# Altium project Mixed Signal Board design Stm32f4xx.PrjPcb
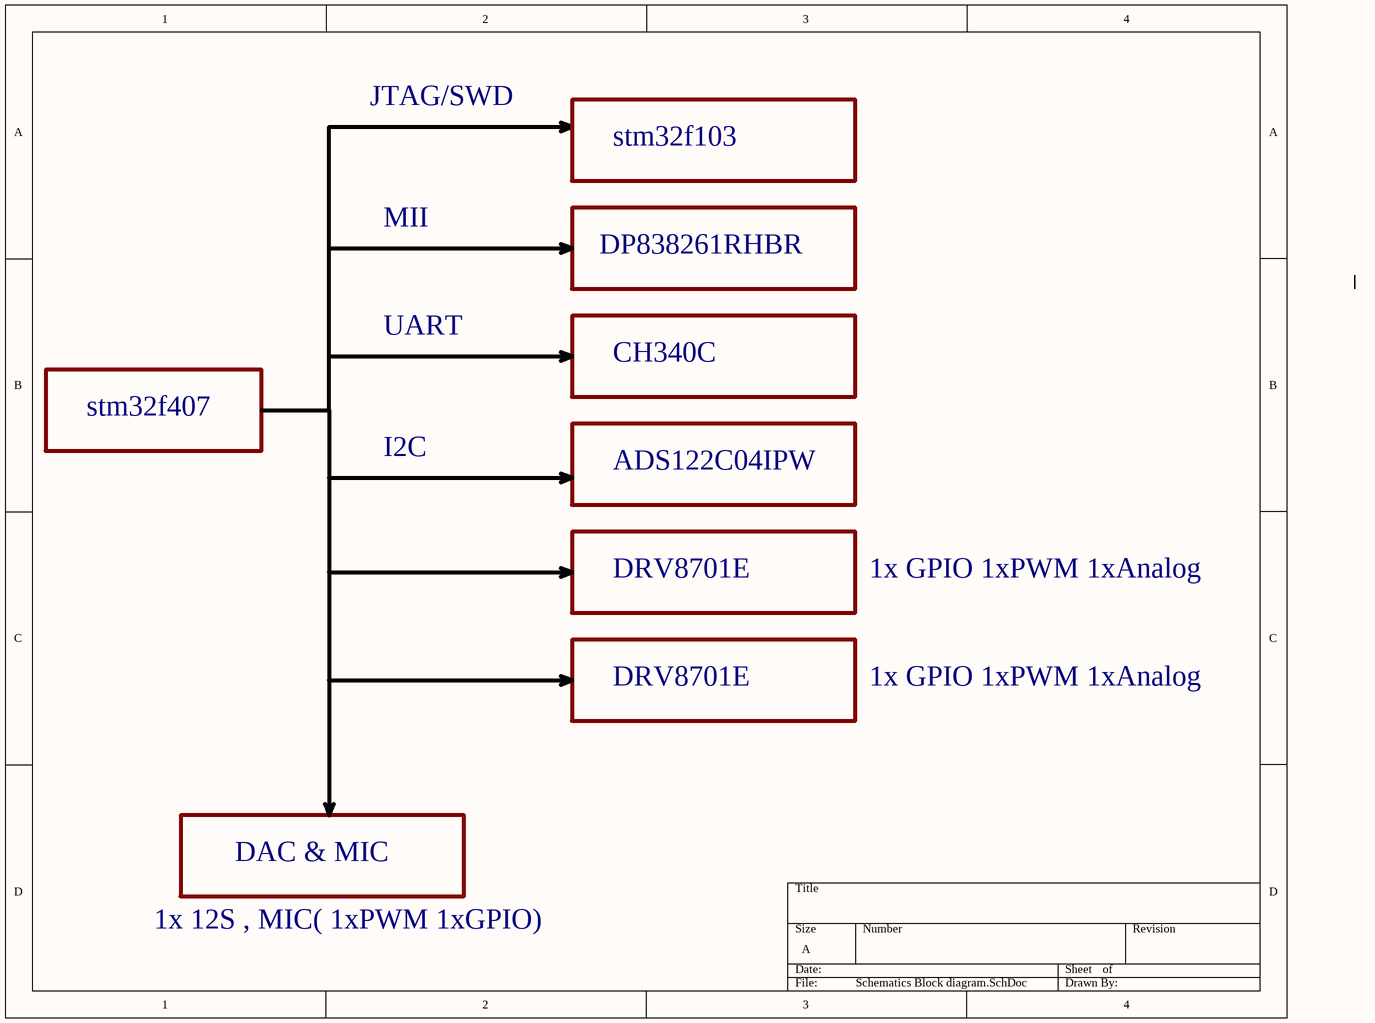
[diagram p0: Schematics Block diagram.SchDoc]
9 sheets, 128 parts. Net scope: flat (ports and power ports of the same name join across sheets).
Sheets:
  Schematics Block diagram.SchDoc
  Power Budget.SchDoc
  stm32f103-debugger.SchDoc
  Ethernet PHY.SchDoc
  Motor Driver.SchDoc
  CH340C UART USB.SchDoc
  ADC Chip.SchDoc
  DAC schematic.SchDoc
  Stm32f407 controller.SchDoc

## Sheet Schematics Block diagram.SchDoc
size A; SheetNumber: 1; SheetTotal: 1

### Notes on the sheet
- JTAG/SWD
- stm32f103
- MII
- DP838261RHBR
- UART
- CH340C
- stm32f407
- I2C
- ADS122C04IPW
- DRV8701E
- 1x GPIO 1xPWM 1xAnalog
- DAC & MIC
- 1x 12S , MIC( 1xPWM 1xGPIO)

## Sheet Power Budget.SchDoc
size A; SheetNumber: 2; SheetTotal: 2
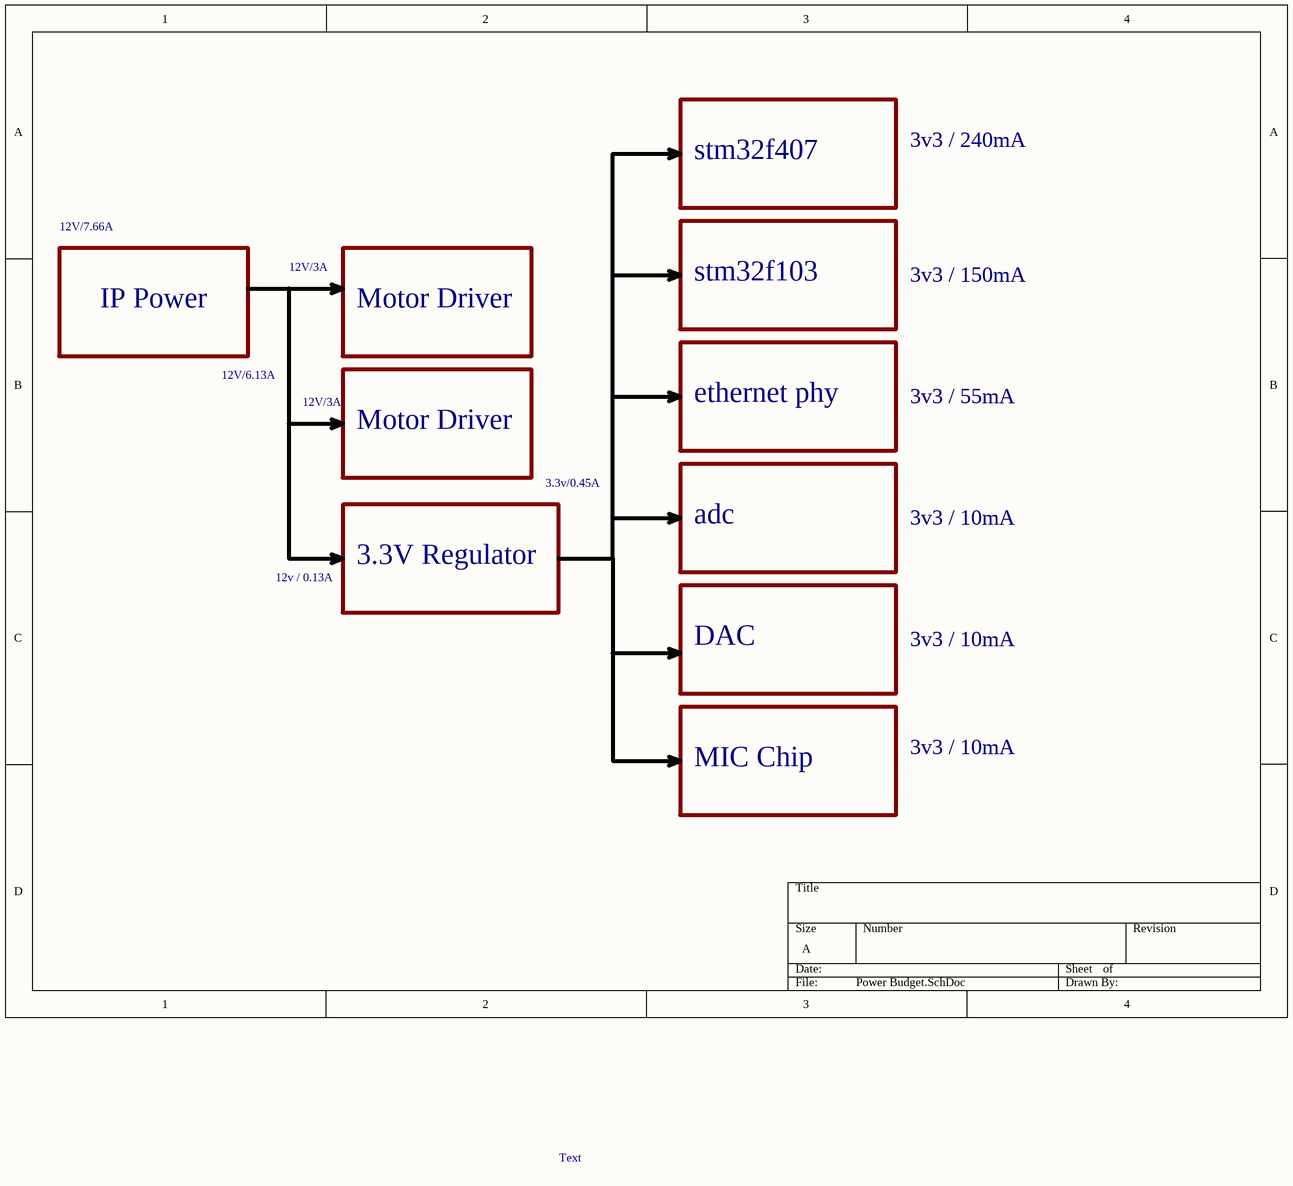
[diagram p1: Power Budget.SchDoc]

### Notes on the sheet
- stm32f407
- 3v3 / 240mA
- 12V/7.66A
- 12V/3A
- stm32f103
- 3v3 / 150mA
- IP Power
- Motor Driver
- 12V/6.13A
- ethernet phy
- 3v3 / 55mA
- 3.3v/0.45A
- 3.3V Regulator
- adc
- 3v3 / 10mA
- 12v / 0.13A
- DAC
- MIC Chip
- Text

## Sheet stm32f103-debugger.SchDoc
size A; SheetNumber: 3; SheetTotal: 3
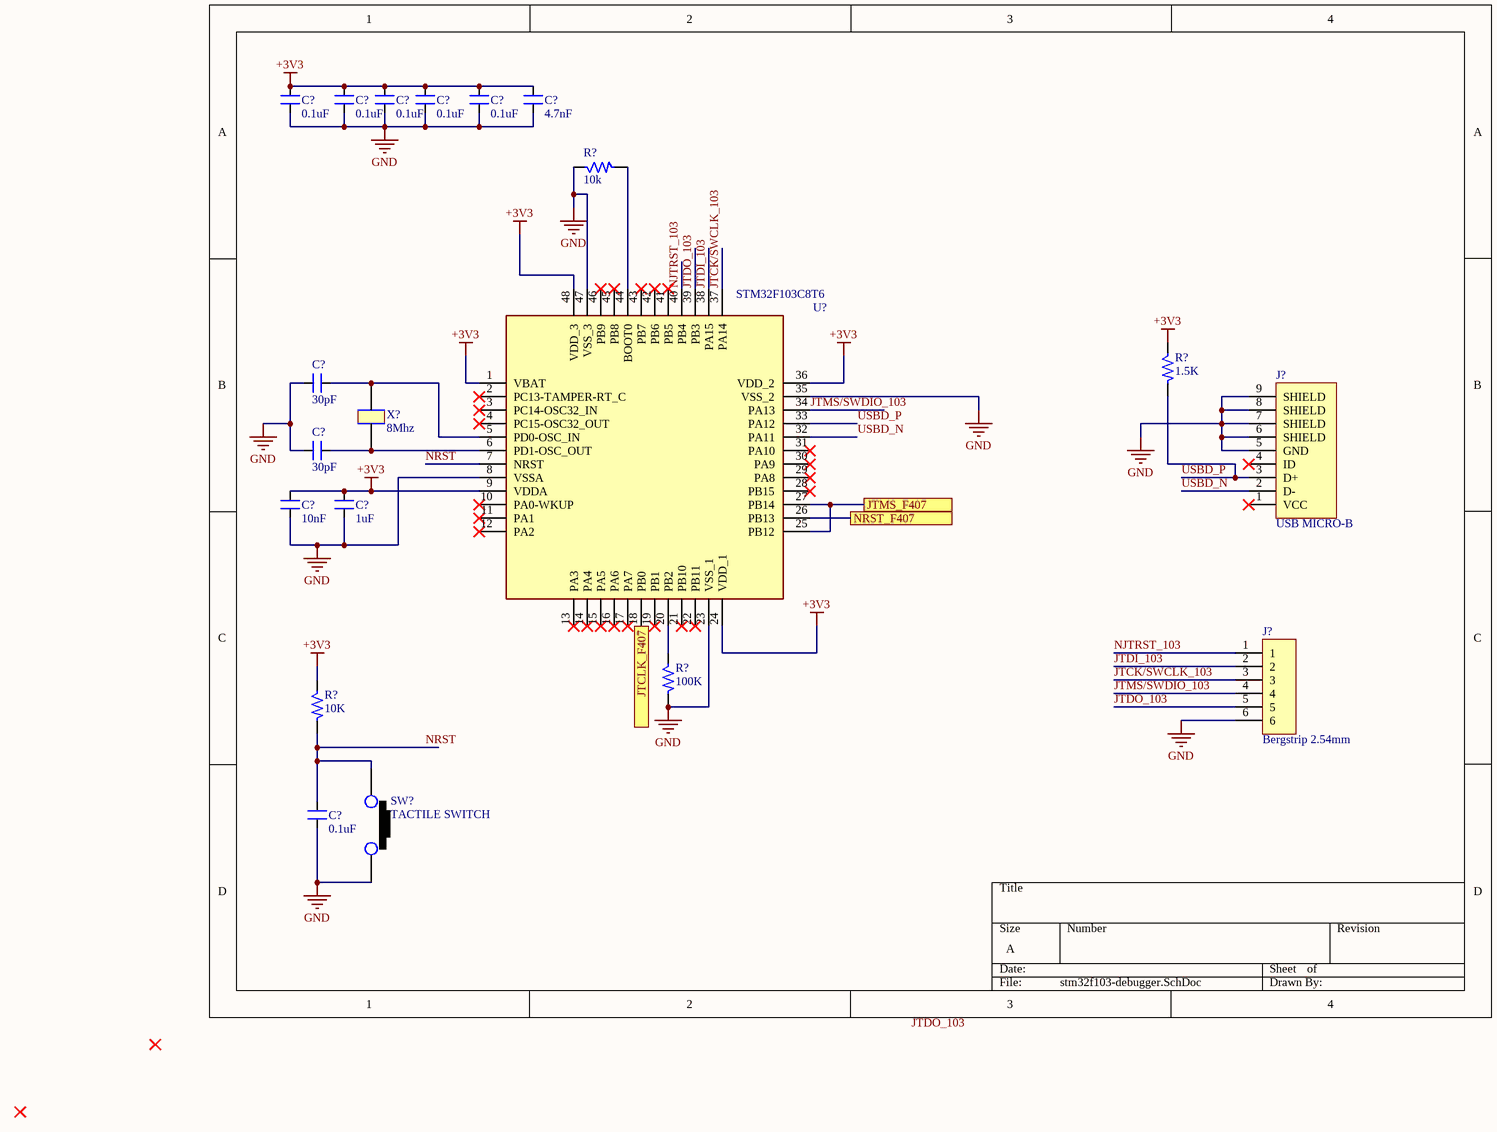
[diagram p2: stm32f103-debugger.SchDoc]

### Parts
(Parts that share a designator on the sheet are numbered #1, #2 ... from top to bottom, then left to right.)
C?#1  0.1uF  [CAP_0805]
C?#2  0.1uF  [CAP_0805]
C?#3  0.1uF  [CAP_0805]
C?#4  0.1uF  [CAP_0805]
C?#5  0.1uF  [CAP_0805]
C?#6  4.7nF  [CAP_0805]
C?#7  30pF  [CAP_0805]
C?#8  30pF  [CAP_0805]
C?#9  10nF  [CAP_0805]
C?#10  1uF  [CAP_0805]
C?#11  0.1uF  [CAP_0805]
J?#1  USB MICRO-B  [CON_10118192-0001LF_SMD]
J?#2  Bergstrip 2.54mm  [CON6_100_59D78_TH_ST]
R?#1  10k  [RES_0603]
R?#2  1.5K  [RES_0805]
R?#3  100K  [RES_0603]
R?#4  10K  [RES_0603]
SW?#1  TACTILE SWITCH  [SW_342_SMD]
U?#1  STM32F103C8T6  [LQFP-48_19.6_393_58X11_SMD]
X?#1  8Mhz  [XTAL_314_240X47_SMD]

### Ports
JTCLK_F407, JTMS_F407, NRST_F407

### Nets
+3V3: C?#1.1 C?#2.1 C?#3.1 C?#4.1 C?#5.1 C?#6.1 C?#9.1 C?#10.1 R?#2.1 R?#4.1 U?#1.1(VBAT) U?#1.9(VDDA) U?#1.24(VDD_1) U?#1.36(VDD_2) U?#1.48(VDD_3)
GND: C?#1.2 C?#2.2 C?#3.2 C?#4.2 C?#5.2 C?#6.2 C?#7.1 C?#8.1 C?#9.2 C?#10.2 C?#11.2 J?#1.5(GND) J?#1.6(SHIELD) J?#1.7(SHIELD) J?#1.8(SHIELD) J?#1.9(SHIELD) J?#2.6 R?#1.1 R?#3.2 SW?#1.2 U?#1.8(VSSA) U?#1.23(VSS_1) U?#1.35(VSS_2) U?#1.47(VSS_3)  [project net SN]
JTCK/SWCLK_103: J?#2.3 U?#1.37(PA14)
JTDI_103: J?#2.2 U?#1.38(PA15)
JTDO_103: J?#2.5 U?#1.39(PB3)
JTMS/SWDIO_103: J?#2.4 U?#1.34(PA13)
NJTRST_103: J?#2.1 U?#1.40(PB4)
NRST: C?#11.1 R?#4.2 SW?#1.1 U?#1.7(NRST)
USBD_N: J?#1.2(D-) U?#1.32(PA11)
USBD_P: J?#1.3(D+) R?#2.2 U?#1.33(PA12)
NetC?#7_2: C?#7.2 U?#1.5(PD0-OSC_IN) X?#1.1
NetC?#8_2: C?#8.2 U?#1.6(PD1-OSC_OUT) X?#1.2
NetR?#1_2: R?#1.2 U?#1.44(BOOT0)
NetR?#3_1: R?#3.1 U?#1.20(PB2)
NetU?#1_18: U?#1.18(PB0) ; port JTCLK_F407
NetU?#1_25: U?#1.25(PB12) U?#1.27(PB14) ; port JTMS_F407
NetU?#1_26: U?#1.26(PB13) ; port NRST_F407

Not connected (* = marked no-connect by the designer): J?#1 1(VCC)* 4(ID)*; U?#1 2(PC13-TAMPER-RT_C)* 3(PC14-OSC32_IN)* 4(PC15-OSC32_OUT)* 10(PA0-WKUP)* 11(PA1)* 12(PA2)* 13(PA3)* 14(PA4)* 15(PA5)* 16(PA6)* 17(PA7)* 19(PB1)* 21(PB10)* 22(PB11)* 28(PB15)* 29(PA8)* 30(PA9)* 31(PA10)* 41(PB5)* 42(PB6)* 43(PB7)* 45(PB8)* 46(PB9)*

### Notes on the sheet
- Labels drawn without touching a wire or pin: JTDO_103

### Library data of the parts
C?#1-C?#5 = CAP_0.1uF-50V-10%-0805: 0.1µF ±10% 50V Ceramic Capacitor X7R 0805 (2012 Metric); Manufacturer: Samsung; Manufacturer Part Number: CL21B104KBCNNNC; Alternate Part Number-1: NA; Case/Package: 0805; Supplier-1: SIRICOM; Supplier Part Number-1: 0805B104K500CT
C?#6 = CAP_4.7nF-50V-10%-0805: 4700pF ±10% 50V Ceramic Capacitor X7R 0805 (2012 Metric); Manufacturer: TDK; Manufacturer Part Number: C0805C472K5RECAUTO; Alternate Part Number-1: NA; Case/Package: 0805; Supplier-1: SIRICOM; Supplier Part Number-1: 0805N472J500LT
C?#7 C?#8 = CAP_30pF-50V-10%-0805: ±10% 50V Ceramic Capacitor C0G, NP0 0805 (2012 Metric); Manufacturer Part Number: C0805C300K5GAC7800; Manufacturer: KEMET; Alternate Part Number: NA; Case/Package: 0805; Supplier-1: Digikey; Supplier Part Number-1: 399-17443-1-ND - Cut Tape (CT)
C?#9 = CAP_10nF-50V-10%-0805: 10000pF ±10% 50V Ceramic Capacitor X7R 0805 (2012 Metric); Manufacturer: Samsung; Manufacturer Part Number: C0805C103K5RECAUTO; Alternate Part Number-1: GRM2195C1H103JA01D; Case/Package: 0805; Supplier-1: SIRICOM; Supplier Part Number-1: 0805B103K500CT
C?#10 = CAP_1uF-50V-5%-0805: 1µF ±5% 50V Ceramic Capacitor X7R 0805 (2012 Metric); Manufacturer: Samsung; Manufacturer Part Number: CC0805JKX7R9BB105; Alternate Part Number-1: 0805F105M500NT; Case/Package: 0805; Supplier-1: SIRICOM; Supplier Part Number-1: CL21B105KBFNNNE
C?#11 = CAP_0.1uF-50V-5%-0805: 0.1µF ±5% 50V Ceramic Capacitor X7R 0805 (2012 Metric); Manufacturer: AVX Corporation; Manufacturer Part Number: 08055C104JAT4A; Alternate Part Number-1: 0805B104M500; Case/Package: 0805; Supplier-1: SIRICOM; Supplier Part Number-1: 0805B104J500CT
J?#1 = CON_USB2.0_MICROB-SMD: USB - micro B USB 2.0 Receptacle Connector 5 Position Surface Mount, Right Angle; Manufacturer: ICC; Manufacturer Part Number: 10118192-0001LF; Alternate Part Number-1: NA; Case/Package: USB MICRO-B SMD; Supplier-1: SUNROM; Supplier Part Number-1: MICRO USB
J?#2 = CON-BS-SKT_6X1-100-ST-TH: 6 Pins, 1 Row 2.54mm Pitch, Straight bergstrip, Female; Manufacturer: Molex; Alternate Part Number-1: NA; Manufacturer Part Number: 22-10-2061; Case/Package: TH-CON; Supplier-1: SP ROAD; Supplier Part Number-1: NA
R?#1 R?#3 = RES_100K-0.1W-1%-0603: 100 kOhms ±1% 0.1W, 1/10W Chip Resistor 0603 (1608 Metric) Automotive AEC-Q200 Thick Film; Manufacturer: Stackpole Electronics; Manufacturer Part Number: RMCF0603FT100K; Alternate Part Number-1: NA; Case/Package: 0603; Supplier-1: Arrow; Supplier Part Number-1: RMCF0603FT100K
R?#2 = RES_1.5K-0.125W-1%-0805: 1.5 kOhms ±1% 0.125W, 1/8W Chip Resistor 0805 (2012 Metric) Thick Film; Manufacturer: TE Connectivity Passive Product; Manufacturer Part Number: CRG0805F1K5; Alternate Part Number-1: NA; Case/Package: 0805; Supplier-1: SIRICOM; Supplier Part Number-1: NA
R?#4 = RES_10K-0.1W-1%-0603: 10 kOhms ±1% 0.1W, 1/10W Chip Resistor 0603 (1608 Metric) Automotive AEC-Q200 Thick Film; Manufacturer: Walsin; Manufacturer Part Number: WR06X1002FTL; Alternate Part Number-1: 0603WAJ0103T5E; Case/Package: 0603; Supplier-1: SIRICOM; Supplier Part Number-1: WR06X1002FTL
SW?#1 = SW1_RS-282G05A3-SMRT-SMD: Tactile Switch SPST-NO Top Actuated Surface Mount; Manufacturer: ITT C&K; Alternate Part Number-1: NA; Manufacturer Part Number: RS-282G05A3-SMRT; Case/Package: SMD; Supplier-1: SP ROAD; Supplier Part Number-1: RS-282G05A3-SMRT
U?#1 = IC_STM32F103C8T6: ARM® Cortex®-M3 STM32F1 Microcontroller IC 32-Bit 72MHz 64KB (64K x 8) FLASH 48-LQFP (7x7); Manufacturer: STMicroelectronics; Alternate Part Number-1: NA; Manufacturer Part Number: STM32F103C8T6; Case/Package: LQFP48; Supplier-1: LCSC; Supplier Part Number-1: STM32F103C8T6
X?#1 = XTAL_8MHZ-ECS-80-32-5PX-SMD: 8MHz ±30ppm Crystal 32pF 60 Ohms HC-49/US; Manufacturer: Fox Electronics; Manufacturer Part Number: ECS-80-32-5PX-TR; Alternate Part Number-1: NA; Case/Package: SMD/SMT; Supplier-1: SP ROAD; Supplier Part Number-1: ECS-80-32-5PX-TR

## Sheet Ethernet PHY.SchDoc
size A; SheetNumber: 4; SheetTotal: 4
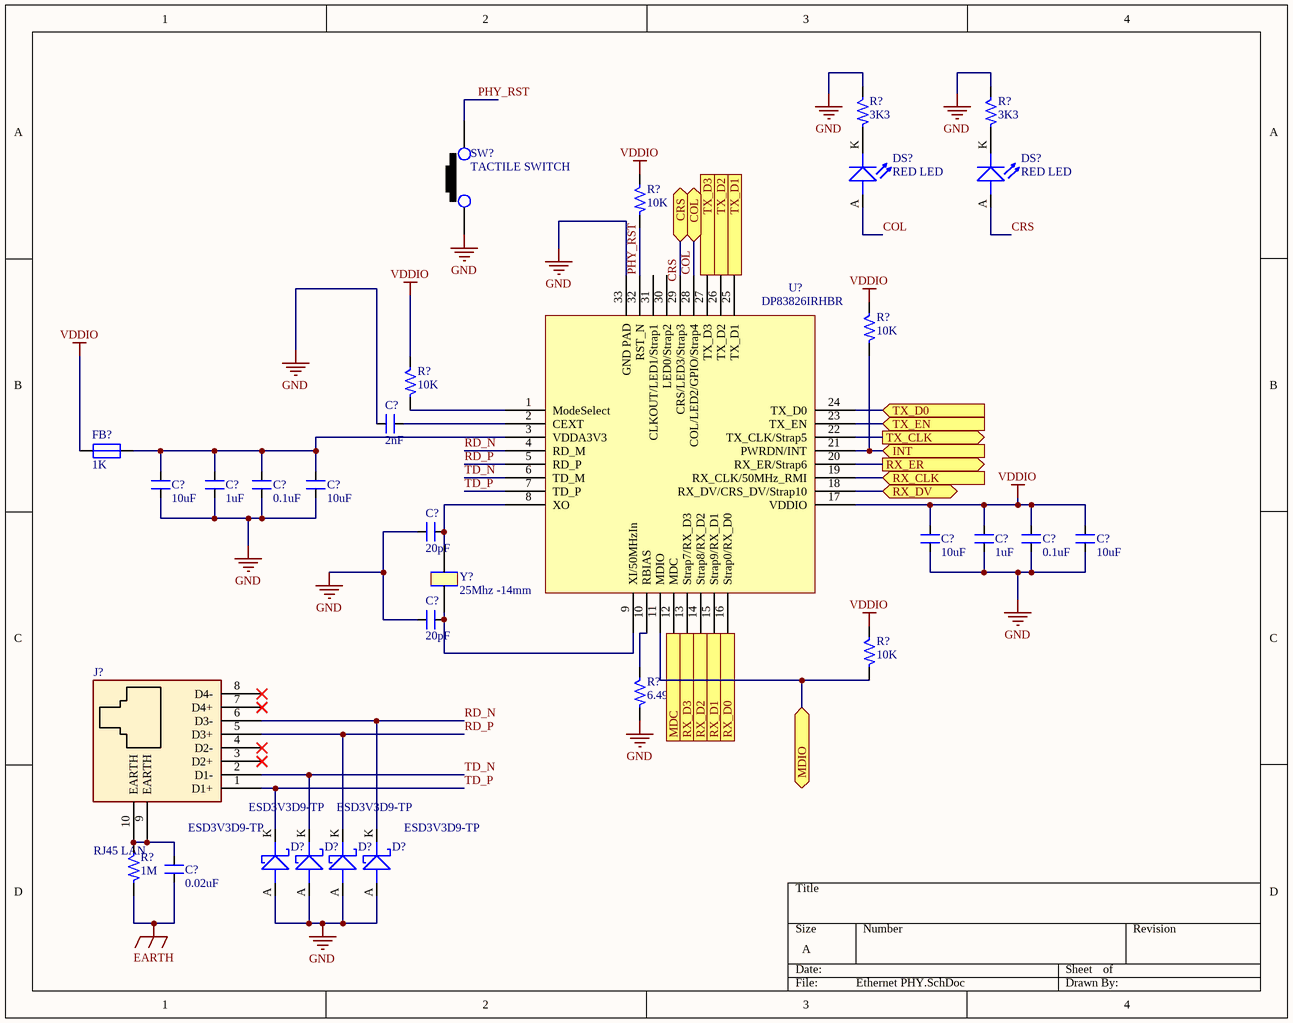
[diagram p3: Ethernet PHY.SchDoc]

### Parts
(Parts that share a designator on the sheet are numbered #1, #2 ... from top to bottom, then left to right.)
C?#12  2nF  [CAP_0805]
C?#13  10uF  [CAP_1206]
C?#14  1uF  [CAP_0805]
C?#15  0.1uF  [CAP_0805]
C?#16  10uF  [CAP_1206]
C?#17  20pF  [CAP_0805]
C?#18  10uF  [CAP_1206]
C?#19  1uF  [CAP_0805]
C?#20  0.1uF  [CAP_0805]
C?#21  10uF  [CAP_1206]
C?#22  20pF  [CAP_0805]
C?#23  0.02uF  [CAP_1812]
D?#1  ESD3V3D9-TP  [DIO_SOD-923]
D?#2  ESD3V3D9-TP  [DIO_SOD-923]
D?#3  ESD3V3D9-TP  [DIO_SOD-923]
D?#4  ESD3V3D9-TP  [DIO_SOD-923]
DS?#1  RED LED  [LED_0805]
DS?#2  RED LED  [LED_0805]
FB?#1  1K  [IND_0805]
J?#3  RJ45 LAN  [CON10_P106_RJ45_TH_ST]
R?#5  3K3  [RES_0603]
R?#6  3K3  [RES_0603]
R?#7  10K  [RES_0603]
R?#8  10K  [RES_0603]
R?#9  10K  [RES_0603]
R?#10  10K  [RES_0805]
R?#11  6.49K  [RES_0805]
R?#12  1M  [RES_1206]
SW?#2  TACTILE SWITCH  [SW_342_SMD]
U?#2  DP83826IRHBR  [VQFN32_19_218_23X9_SMD]
Y?  25Mhz -14mm  [XTAL_314_240X47_SMD]

### Ports
COL (bidir), CRS (bidir), INT (in), MDC (in), MDIO (bidir), RX_CLK (in), RX_D0 (out), RX_D1 (out), RX_D2 (out), RX_D3 (out), RX_DV (bidir), RX_ER (out), TX_CLK (out), TX_D0 (in), TX_D1 (in), TX_D2 (in), TX_D3 (in), TX_EN (in)

### Nets
EARTH: C?#23.1 R?#12.2
GND: C?#12.1 C?#13.2 C?#14.2 C?#15.2 C?#16.2 C?#17.1 C?#18.2 C?#19.2 C?#20.2 C?#21.2 C?#22.1 D?#1.A D?#2.A D?#3.A D?#4.A R?#5.1 R?#6.1 R?#11.2 SW?#2.1 U?#2.33(GND_PAD)  [project net SN]
VDDIO: C?#18.1 C?#19.1 C?#20.1 C?#21.1 FB?#1.1 R?#7.1 R?#8.1 R?#9.1 R?#10.1 U?#2.17(VDDIO)
COL: DS?#1.A(ANODE) U?#2.28(COL/LED2/GPIO/Strap4) ; port COL
CRS: DS?#2.A(ANODE)
PHY_RST: R?#7.2 SW?#2.2 U?#2.32(RST_N)
RD_N: D?#4.K J?#3.6(D3-) U?#2.4(RD_M)
RD_P: D?#3.K J?#3.5(D3+) U?#2.5(RD_P)
TD_N: D?#2.K J?#3.2(D1-) U?#2.6(TD_M)
TD_P: D?#1.K J?#3.1(D1+) U?#2.7(TD_P)
NetC?#12_2: C?#12.2 U?#2.2(CEXT)
NetC?#13_1: C?#13.1 C?#14.1 C?#15.1 C?#16.1 FB?#1.2 U?#2.3(VDDA3V3)
NetC?#17_2: C?#17.2 U?#2.8(XO) Y?.1
NetC?#22_2: C?#22.2 U?#2.9(XI/50MHzIn) Y?.2
NetC?#23_2: C?#23.2 J?#3.9(EARTH) J?#3.10(EARTH) R?#12.1
NetDS?#1_K: DS?#1.K(CATHODE) R?#5.2
NetDS?#2_K: DS?#2.K(CATHODE) R?#6.2
NetR?#8_2: R?#8.2 U?#2.21(PWRDN/INT) ; port INT
NetR?#9_2: R?#9.2 U?#2.1(ModeSelect)
NetR?#10_2: R?#10.2 U?#2.11(MDIO) ; port MDIO
NetR?#11_1: R?#11.1 U?#2.10(RBIAS)
NetU?#2_12: U?#2.12(MDC) ; port MDC
NetU?#2_13: U?#2.13(Strap7/RX_D3) ; port RX_D3
NetU?#2_14: U?#2.14(Strap8/RX_D2) ; port RX_D2
NetU?#2_15: U?#2.15(Strap9/RX_D1) ; port RX_D1
NetU?#2_16: U?#2.16(Strap0/RX_D0) ; port RX_D0
NetU?#2_18: U?#2.18(RX_DV/CRS_DV/Strap10) ; port RX_DV
NetU?#2_19: U?#2.19(RX_CLK/50MHz_RMI) ; port RX_CLK
NetU?#2_20: U?#2.20(RX_ER/Strap6) ; port RX_ER
NetU?#2_22: U?#2.22(TX_CLK/Strap5) ; port TX_CLK
NetU?#2_23: U?#2.23(TX_EN) ; port TX_EN
NetU?#2_24: U?#2.24(TX_D0) ; port TX_D0
NetU?#2_25: U?#2.25(TX_D1) ; port TX_D1
NetU?#2_26: U?#2.26(TX_D2) ; port TX_D2
NetU?#2_27: U?#2.27(TX_D3) ; port TX_D3
NetU?#2_29: U?#2.29(CRS/LED3/Strap3) ; port CRS

Not connected (* = marked no-connect by the designer): J?#3 3(D2+)* 4(D2-)* 7(D4+)* 8(D4-)*; U?#2 30(LED0/Strap2) 31(CLKOUT/LED1/Strap1)

### Notes on the sheet
- Labels drawn without touching a wire or pin: CRS

### Library data of the parts
C?#12 = CAP_2nF-50V-10%-0805: 2000pF ±10% 50V Ceramic Capacitor X7R 0805 (2012 Metric); Manufacturer: Samsung Electro-Mechanics; Manufacturer Part Number: CL21B202KBANNNC; Alternate Part Number-1: NA; Case/Package: 0805; Supplier-1: Digikey; Supplier Part Number-1: 1276-2471-1-ND - Cut Tape (CT)
C?#13 C?#16 C?#18 C?#21 = CAP_10uF-50V-10%-1206: 10µF ±10% 50V Ceramic Capacitor X7R 1206 (3216 Metric); Manufacturer: KEMET; Manufacturer Part Number: CL31B106KBHNNNE; Alternate Part Number-1: GRT31CR61H106ME01L; Case/Package: 1206; Supplier-1: SIRICOM; Supplier Part Number-1: CC1206KKX5R9BB106
C?#14 C?#19 = CAP_1uF-50V-5%-0805: as C?#10 on sheet stm32f103-debugger; Case/Package: 0805; Supplier-1: SIRICOM; Supplier Part Number-1: CL21B105KBFNNNE
C?#15 C?#20 = CAP_0.1uF-50V-5%-0805: as C?#11 on sheet stm32f103-debugger; Case/Package: 0805; Supplier-1: SIRICOM; Supplier Part Number-1: 0805B104J500CT
C?#17 C?#22 = CAP_20pF-50V-10%-0805: ±10% 50V Ceramic Capacitor C0G, NP0 0805 (2012 Metric); Manufacturer: AVX Corporation; Manufacturer Part Number: 08055A200KAT2A; Alternate Part Number-1: NA; Case/Package: 0805; Supplier-1: Digikey; Supplier Part Number-1: 478-11887-1-ND - Cut Tape (CT)
C?#23 = CAP_20nF-1KV-20%-1812: 0.02µF ±20% 1000V (1kV) Ceramic Capacitor X7R 1812 (4532 Metric); Manufacturer: TDK; Manufacturer Part Number: 1812AC203MAT1A; Alternate Part Number-1: NA; Case/Package: 1812; Supplier-1: Mouser; Supplier Part Number-1: 581-1812AC203M
D?#1-D?#4 = DIO-T_3.3V-8.8V-SOD923: 8.8V Clamp 5A (8/20µs) Ipp Tvs Diode Surface Mount SOD-923; Manufacturer: Micro Commercial Co; Alternate Part Number-1: NA; Manufacturer Part Number: ESD3V3D9-TP; Case/Package: SOD923; Supplier-1: Digikey; Supplier Part Number-1: ESD3V3D9-TPMSCT-ND - Cut Tape (CT)
DS?#1 DS?#2 = LED_RED-2V-20mA-0805: Red 631nm LED Indication - Discrete 2V 0805 (2012 Metric); Manufacturer: Vishay Lite-On; Manufacturer Part Number: LTST-C171KRKT; Alternate Part Number-1: NA; Case/Package: 0805; Supplier-1: SP ROAD; Supplier Part Number-1: LTST-C171KRKT
FB?#1 = FB_1K-100MHZ-1.6A-0805: 1 kOhms @ 100MHz 1 Power Line Ferrite Bead 0805 (2012 Metric) 1.6A; Manufacturer: Laird; Manufacturer Part Number: BLM21SP102SH1D; Alternate Part Number-1: NA; Case/Package: 0805; Supplier-1: SIRICOM; Supplier Part Number-1: ACMS201209A102
J?#3 = CON-SKT-RJ_8C8P-RA-TH: 8 Pins, 2 Row 2.54mm Pitch, right angle Connector, male; Manufacturer: Assmann; Manufacturer Part Number: A-2004-2-4-LPS-N-R; Alternate Part Number-1: NA; Case/Package: TH-CON; Supplier-1: SP ROAD; Supplier Part Number-1: A-2004-2-4-LPS-N-R
R?#5 R?#6 = RES_3.3K-0.1W-1%-0603: 3.3 kOhms ±1% 0.1W, 1/10W Chip Resistor 0603 (1608 Metric) Automotive AEC-Q200 Thick Film; Manufacturer: Wilson; Manufacturer Part Number: WR06X3301FTL; Alternate Part Number-1: 0603WAF3301T5E; Case/Package: 0603; Supplier-1: SIRICOM; Supplier Part Number-1: WR06X3301FTL
R?#7-R?#9 = RES_10K-0.1W-1%-0603: as R?#4 on sheet stm32f103-debugger; Case/Package: 0603; Supplier-1: SIRICOM; Supplier Part Number-1: WR06X1002FTL
R?#10 = RES_10K-0.125W-1%-0805: 10 kOhms ±1% 0.125W, 1/8W Chip Resistor 0805 (2012 Metric) Automotive AEC-Q200 Thick Film; Manufacturer: CTS; Manufacturer Part Number: WR08X1002FTL; Case/Package: 0805; Supplier-1: SIRICOM; Supplier Part Number-1: WR08X1002FTL; Alternate Part Number-1: WR08X1002FTL
R?#11 = RES_6.49K-0.125W-1%-0805: 6.49 kOhms ±1% 0.125W, 1/8W Chip Resistor 0805 (2012 Metric) Moisture Resistant Thick Film; Manufacturer: Stackpole Electronics; Manufacturer Part Number: RC0805FR-076K49L; Alternate Part Number-1: NA; Case/Package: 0805; Supplier-1: SIRICOM; Supplier Part Number-1: WRO8X6491FTL
R?#12 = RES_1M-0.25W-1%-1206: 1 MOhms ±1% 0.25W, 1/4W Chip Resistor 1206 (3216 Metric) Automotive AEC-Q200, High Voltage Thick Film; Manufacturer: Walsin; Manufacturer Part Number: WR12X1004FTL; Alternate Part Number-1: NA; Case/Package: 1206; Supplier-1: SIRICOM; Supplier Part Number-1: WR12X1004FTL
SW?#2 = SW1_RS-282G05A3-SMRT-SMD: as SW?#1 on sheet stm32f103-debugger; Manufacturer Part Number: RS-282G05A3-SMRT; Case/Package: SMD; Supplier-1: SP ROAD; Supplier Part Number-1: RS-282G05A3-SMRT
U?#2 = IC_DP83826IRHBR: Ethernet ICs Low latency 10/100-Mbps PHY, MII interface and enhanced mode with an industrial temperature range 32-VQFN -40 to 85; Manufacturer: Texas Instruments; Alternate Part Number-1: NA; Manufacturer Part Number: DP83826IRHBR; Case/Package: 32-VQFN; Supplier-1: Mouser; Supplier Part Number-1: 595-DP83826IRHBR
Y? = XTAL_25Mhz-FOXSDLF/250F-20: 25MHz ±30ppm Crystal 20pF 30 Ohms HC-49/US; Manufacturer: Abracon; Alternate Part Number-1: NA; Manufacturer Part Number: FOXSDLF/250F-20; Case/Package: SMD; Supplier-1: MOUSER; Supplier Part Number-1: FOXSDLF/250F-20

## Sheet Motor Driver.SchDoc
size A; SheetNumber: 5; SheetTotal: 6
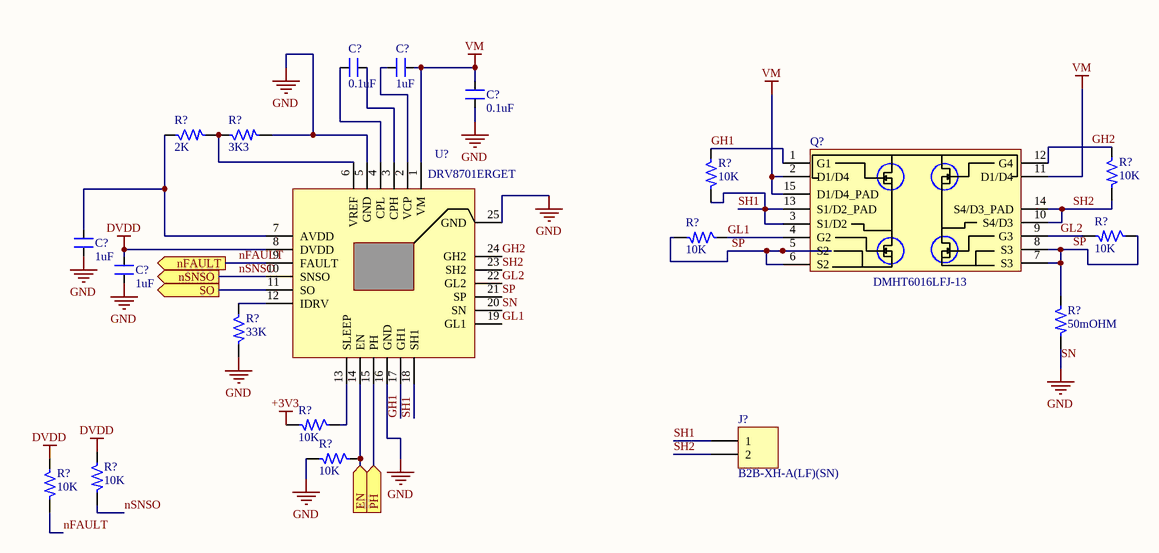
[diagram p4: Motor Driver.SchDoc]

### Parts
(Parts that share a designator on the sheet are numbered #1, #2 ... from top to bottom, then left to right.)
C?#24  0.1uF  [CAP_0805]
C?#25  1uF  [CAP_0805]
C?#26  0.1uF  [CAP_0805]
C?#27  1uF  [CAP_0805]
C?#28  1uF  [CAP_0805]
J?#4  B2B-XH-A(LF)(SN)  [CON2_100_B2B-XH-A_TH_ST]
Q?  DMHT6016LFJ-13  [DFN5045-12_33_212_27X15_SMD_1]
R?#13  2K  [RES_0603]
R?#14  3K3  [RES_0603]
R?#15  10K  [RES_0603]
R?#16  10K  [RES_0603]
R?#17  10K  [RES_0603]
R?#18  10K  [RES_0603]
R?#19  50mOHM  [RES_2512]
R?#20  33K  [RES_0805]
R?#21  10K  [RES_0603]
R?#22  10K  [RES_0603]
R?#23  10K  [RES_0603]
R?#24  10K  [RES_0603]
U?#3  DRV8701ERGET  [VFQFN24_19.6_196_12X32_SMD_1]

### Ports
EN (in), nFAULT (out), nSNSO (out), PH (in), SO (out)

### Nets
+3V3: R?#21.2
DVDD: C?#28.1 R?#22.1 R?#23.1 U?#3.8(DVDD)
SN: C?#26.2 C?#27.2 C?#28.2 R?#14.2 R?#19.2 R?#20.2 R?#24.2 U?#3.5(GND) U?#3.16(GND) U?#3.20(SN) U?#3.25(GND)  [also labelled GND]
VM: C?#25.2 C?#26.1 Q?.2(D1/D4) Q?.11(D1/D4) Q?.15(D1/D4_PAD) U?#3.1(VM)
GH1: Q?.1(G1) R?#15.1 U?#3.17(GH1)
GH2: Q?.12(G4) R?#16.1 U?#3.24(GH2)
GL1: Q?.4(G2) R?#17.1 U?#3.19(GL1)
GL2: Q?.9(G3) R?#18.2 U?#3.22(GL2)
nFAULT: R?#23.2 U?#3.9(FAULT) ; port nFAULT
nSNSO: R?#22.2 U?#3.10(SNSO) ; port nSNSO
SH1: J?#4.1 Q?.3(S1/D2) Q?.13(S1/D2_PAD) R?#15.2 U?#3.18(SH1)
SH2: J?#4.2 Q?.10(S4/D3) Q?.14(S4/D3_PAD) R?#16.2 U?#3.23(SH2)
SP: Q?.5(S2) Q?.6(S2) Q?.7(S3) Q?.8(S3) R?#17.2 R?#18.1 R?#19.1 U?#3.21(SP)
NetC?#24_1: C?#24.1 U?#3.3(CPH)
NetC?#24_2: C?#24.2 U?#3.4(CPL)
NetC?#25_1: C?#25.1 U?#3.2(VCP)
NetC?#27_1: C?#27.1 R?#13.1 U?#3.7(AVDD)
NetR?#13_2: R?#13.2 R?#14.1 U?#3.6(VREF)
NetR?#20_1: R?#20.1 U?#3.12(IDRV)
NetR?#21_1: R?#21.1 U?#3.13(SLEEP)
NetR?#24_1: R?#24.1 U?#3.14(EN) ; port EN
NetU?#3_11: U?#3.11(SO) ; port SO
NetU?#3_15: U?#3.15(PH) ; port PH

### Library data of the parts
C?#24 C?#26 = CAP_0.1uF-50V-5%-0805: as C?#11 on sheet stm32f103-debugger; Case/Package: 0805; Supplier-1: SIRICOM; Supplier Part Number-1: 0805B104J500CT
C?#25 C?#27 C?#28 = CAP_1uF-50V-5%-0805: as C?#10 on sheet stm32f103-debugger; Case/Package: 0805; Supplier-1: SIRICOM; Supplier Part Number-1: CL21B105KBFNNNE
J?#4 = CON-PLG_2X1-100-ST-TH: 2 Pins, 1 Row 2.54mm Pitch, Straight Connector, male; Manufacturer: JST; Mating Part Number: XHP-2; Crimp Part Number: ASXHSXH22K51; Alternate Part Number-1: NA; Manufacturer Part Number: B2B-XH-A(LF)(SN); Case/Package: TH-CON; Supplier-1: SP ROAD; Supplier Part Number-1: B2B-XH-A(LF)(SN)
Q? = MOSFET-N_60V-14.8A-V-DFN5045-12: Mosfet Array 4 N-Channel 14.8A (Ta) Surface Mount V-DFN5045-12; Manufacturer: ON Semiconductor; Alternate Part Number-1: DMHT3006LFJ-13; Manufacturer Part Number: DMHT6016LFJ-13; Case/Package: DFN5045-12; Supplier-1: LCSC; Supplier Part Number-1: C460986
R?#13 = RES_2K-0.125W-1%-0603: 2 kOhms ±1% 0.125W, 1/8W Chip Resistor 0603 (1608 Metric) Anti-Sulfur, Moisture Resistant Thin Film; Manufacturer: Stackpole Electronics; Manufacturer Part Number: RNCP0603FTD2K00; Alternate Part Number-1: NA; Case/Package: 0603; Supplier-1: SIRICOM; Supplier Part Number-1: WR06X2001FTL
R?#14 = RES_3.3K-0.1W-1%-0603: as R?#5 on sheet Ethernet PHY; Case/Package: 0603; Supplier-1: SIRICOM; Supplier Part Number-1: WR06X3301FTL
R?#15-R?#18 R?#21-R?#24 = RES_10K-0.1W-1%-0603: as R?#4 on sheet stm32f103-debugger; Case/Package: 0603; Supplier-1: SIRICOM; Supplier Part Number-1: WR06X1002FTL
R?#19 = RES_50mOhm-2W-1%-2512: 50 mOhms ±1% 2W Chip Resistor 2512 (6432 Metric) Automotive AEC-Q200, Current Sense, Moisture Resistant Metal Element; Manufacturer: Yageo; Manufacturer Part Number: PA2512FKF7W0R05E; Alternate Part Number-1: PMR100HZPFU5L00; Case/Package: 2512; Supplier-1: SIRICOM; Supplier Part Number-1: LR2512-22R060F1
R?#20 = RES_33K-0.125W-1%-0805: Thick Film Resistors - SMD 33KOhms 1/8W 150V33 kOhms ±1% 0.125W, 1/8W Chip Resistor 0805 (2012 Metric) Thick Film; Manufacturer: Vishay BCcomponents; Manufacturer Part Number: CRG0805F33K; Alternate Part Number-1: NA; Case/Package: 0805; Supplier-1: SIRICOM; Supplier Part Number-1: WR08X3302FTL
U?#3 = IC_DRV8701ERGET: Motor Driver Power MOSFET Parallel 24-VQFN (4x4); Manufacturer: Texas Instruments; Alternate Part Number-1: NA; Manufacturer Part Number: DRV8701ERGET; Case/Package: VFQFN24; Supplier-1: ARROW; Supplier Part Number-1: DRV8701ERGET

## Sheet CH340C UART USB.SchDoc
size A; SheetNumber: 6; SheetTotal: 6
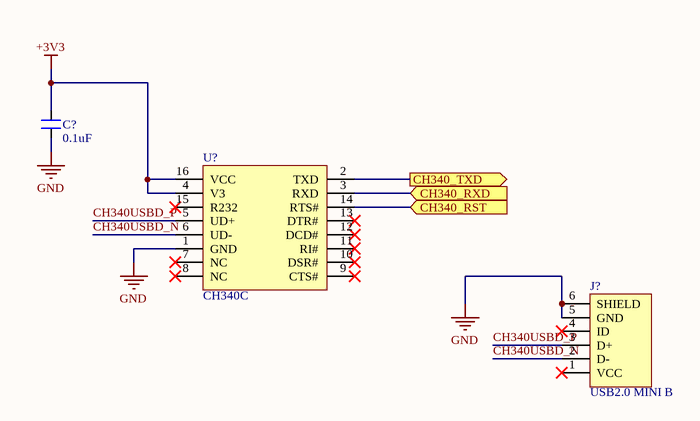
[diagram p5: CH340C UART USB.SchDoc]

### Parts
(Parts that share a designator on the sheet are numbered #1, #2 ... from top to bottom, then left to right.)
C?#29  0.1uF  [CAP_0805]
J?#5  USB2.0 MINI B  [CON_690-005-299-043]
U?#4  CH340C  [SOIC16_50_284_25X90_SMT]

### Ports
CH340_RST (in), CH340_RXD (in), CH340_TXD (out)

### Nets
+3V3: C?#29.1 U?#4.4(V3) U?#4.16(VCC)
GND: C?#29.2 J?#5.5(GND) J?#5.6(SHIELD) U?#4.1(GND)  [project net SN]
CH340USBD_N: J?#5.2(D-) U?#4.6(UD-)
CH340USBD_P: J?#5.3(D+) U?#4.5(UD+)
NetU?#4_2: U?#4.2(TXD) ; port CH340_TXD
NetU?#4_3: U?#4.3(RXD) ; port CH340_RXD
NetU?#4_14: U?#4.14(RTS#) ; port CH340_RST

Not connected (* = marked no-connect by the designer): J?#5 1(VCC)* 4(ID)*; U?#4 7(NC)* 8(NC)* 9(CTS#)* 10(DSR#)* 11(RI#)* 12(DCD#)* 13(DTR#)* 15(R232)*

### Library data of the parts
C?#29 = CAP_0.1uF-50V-5%-0805: as C?#11 on sheet stm32f103-debugger; Case/Package: 0805; Supplier-1: SIRICOM; Supplier Part Number-1: 0805B104J500CT
J?#5 = CON_USB2.0-MINIB-SMD: USB - mini B USB 2.0 Receptacle Connector 5 Position Surface Mount, Right Angle; Manufacturer: EDAC; Manufacturer Part Number: 690-005-299-043; Alternate Part Number-1: NA; Case/Package: USB-MINI-B; Supplier-1: LCSC; Supplier Part Number-1: C105424
U?#4 = IC_CH340C: USB Bridge, USB to UART USB 2.0 UART Interface; Manufacturer: Olimex; Alternate Part Number-1: NA; Manufacturer Part Number: CH340C; Case/Package: SOIC16; Supplier-1: LCSC; Supplier Part Number-1: C84681

## Sheet ADC Chip.SchDoc
size A; SheetNumber: 7; SheetTotal: 7
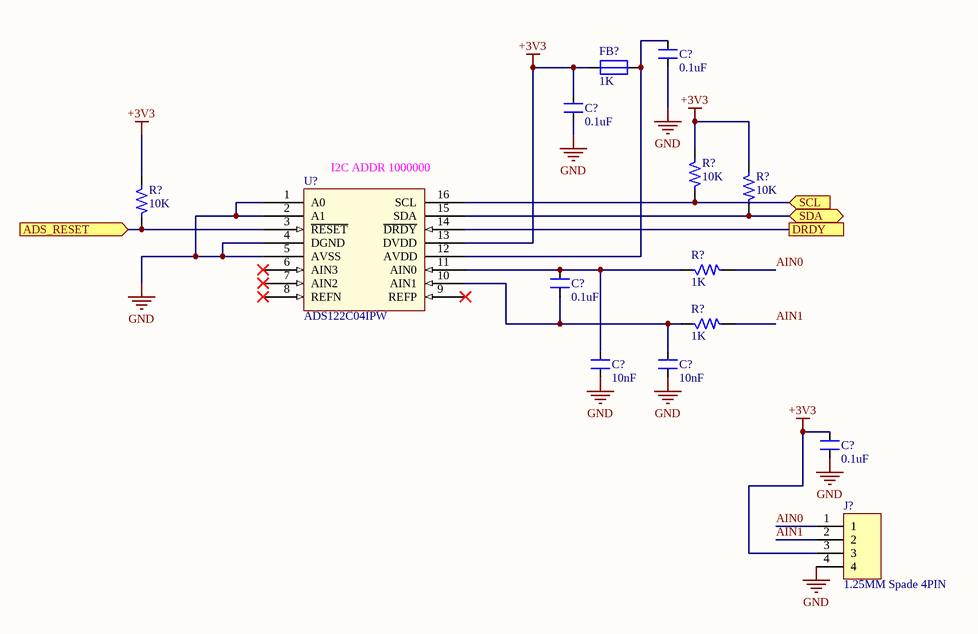
[diagram p6: ADC Chip.SchDoc]

### Parts
(Parts that share a designator on the sheet are numbered #1, #2 ... from top to bottom, then left to right.)
C?#30  0.1uF  [CAP_0805]
C?#31  0.1uF  [CAP_0805]
C?#32  0.1uF  [CAP_0805]
C?#33  10nF  [CAP_0805]
C?#34  10nF  [CAP_0805]
C?#35  0.1uF  [CAP_0805]
FB?#2  1K  [IND_0805]
J?#6  1.25MM Spade 4PIN  [CON4_50_653004117322_TH_RA]
R?#25  10K  [RES_0603]
R?#26  10K  [RES_0603]
R?#27  10K  [RES_0603]
R?#28  1K  [RES_0603]
R?#29  1K  [RES_0603]
U?#5  ADS122C04IPW  [TSSOP16_25-59_294_54X14_SMT]

### Ports
ADS_RESET (in), DRDY, SCL (in), SDA (bidir)

### Nets
+3V3: C?#31.1 C?#35.1 FB?#2.1 J?#6.3 R?#25.1 R?#26.1 R?#27.1 U?#5.13(DVDD)
GND: C?#30.2 C?#31.2 C?#33.2 C?#34.2 C?#35.2 J?#6.4 U?#5.1(A0) U?#5.2(A1) U?#5.4(DGND) U?#5.5(AVSS)  [project net SN]
AIN0: J?#6.1 R?#28.2
AIN1: J?#6.2 R?#29.2
NetC?#30_1: C?#30.1 FB?#2.2 U?#5.12(AVDD)
NetC?#32_1: C?#32.1 C?#33.1 R?#28.1 U?#5.11(AIN0)
NetC?#32_2: C?#32.2 C?#34.1 R?#29.1 U?#5.10(AIN1)
NetR?#25_2: R?#25.2 U?#5.16(SCL) ; port SCL
NetR?#26_2: R?#26.2 U?#5.15(SDA) ; port SDA
NetR?#27_2: R?#27.2 U?#5.3(~{RESET}) ; port ADS_RESET
NetU?#5_14: U?#5.14(~{DRDY}) ; port DRDY

Not connected (* = marked no-connect by the designer): U?#5 6(AIN3)* 7(AIN2)* 8(REFN)* 9(REFP)*

### Notes on the sheet
- (near U?#5) I2C ADDR 1000000

### Library data of the parts
C?#30-C?#32 C?#35 = CAP_0.1uF-50V-5%-0805: as C?#11 on sheet stm32f103-debugger; Case/Package: 0805; Supplier-1: SIRICOM; Supplier Part Number-1: 0805B104J500CT
C?#33 C?#34 = CAP_10nF-50V-10%-0805: as C?#9 on sheet stm32f103-debugger; Case/Package: 0805; Supplier-1: SIRICOM; Supplier Part Number-1: 0805B103K500CT
FB?#2 = FB_1K-100MHZ-1.6A-0805: as FB?#1 on sheet Ethernet PHY; Case/Package: 0805; Supplier-1: SIRICOM; Supplier Part Number-1: ACMS201209A102
J?#6 = CON-PLG_4X1-50-RA-TH: 4 Pins, 1 Row 1.25mm Pitch, right angle Connector, male; Manufacturer Part Number: 653004117322; Manufacturer: JST; Mating Part Number: 653004113322; Crimp Part Number: 653153128130; Alternate Part Number-1: NA; Case/Package: TH-CON; Supplier-1: WURTH; Supplier Part Number-1: 653004117322
R?#25-R?#27 = RES_10K-0.1W-1%-0603: as R?#4 on sheet stm32f103-debugger; Case/Package: 0603; Supplier-1: SIRICOM; Supplier Part Number-1: WR06X1002FTL
R?#28 R?#29 = RES_1K-0.1W-1%-0603: 1 kOhms ±1% 0.1W, 1/10W Chip Resistor 0603 (1608 Metric) Automotive AEC-Q200 Thick Film; Manufacturer: Walsin; Manufacturer Part Number: WR06X1001FTL; Alternate Part Number-1: 0603WAF1001T5E; Case/Package: 0603; Supplier-1: SIRICOM; Supplier Part Number-1: WR06X1001FTL
U?#5 = IC_ADS122C04IPW: 24 Bit Analog to Digital Converter 4 Input 1 Sigma-Delta 16-TSSOP; Manufacturer: Texas Instruments; Alternate Part Number-1: NA; Manufacturer Part Number: ADS122C04IPW; Case/Package: TSSOP16; Supplier-1: MOUSER; Supplier Part Number-1: ADS122C04IPW

## Sheet DAC schematic.SchDoc
size A; SheetNumber: 8; SheetTotal: 8
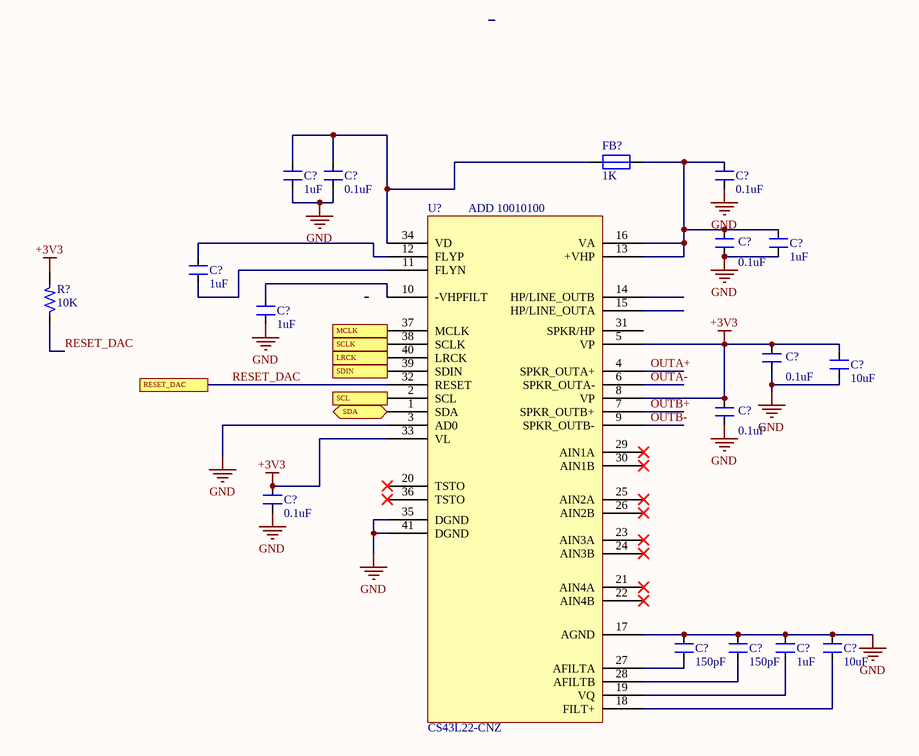
[diagram p7: DAC schematic.SchDoc]

### Parts
(Parts that share a designator on the sheet are numbered #1, #2 ... from top to bottom, then left to right.)
C?#36  1uF  [CAP_0805]
C?#37  0.1uF  [CAP_0805]
C?#38  0.1uF  [CAP_0805]
C?#39  0.1uF  [CAP_0805]
C?#40  1uF  [CAP_0805]
C?#41  1uF  [CAP_0805]
C?#42  1uF  [CAP_0805]
C?#43  0.1uF  [CAP_0805]
C?#44  10uF  [CAP_1206]
C?#45  0.1uF  [CAP_0805]
C?#46  0.1uF  [CAP_0805]
C?#47  150pF  [CAP_0805]
C?#48  150pF  [CAP_0805]
C?#49  1uF  [CAP_0805]
C?#50  10uF  [CAP_1206]
FB?#3  1K  [IND_0805]
R?#30  10K  [RES_0603]
U?#6  CS43L22-CNZ  [QFN40_19_284_33X9_SMD]

### Ports
LRCK, MCLK, RESET_DAC, SCL (in, see ADC Chip[4B]), SCLK, SDA (bidir, see ADC Chip[4B]), SDIN

### Nets
+3V3: C?#43.1 C?#44.2 C?#45.1 C?#46.1 R?#30.2 U?#6.5(VP) U?#6.8(VP) U?#6.33(VL)
GND: C?#36.2 C?#37.2 C?#38.2 C?#39.2 C?#40.2 C?#42.2 C?#43.2 C?#44.1 C?#45.2 C?#46.2 C?#47.2 C?#48.2 C?#49.2 C?#50.2 U?#6.3(AD0) U?#6.17(AGND) U?#6.35(DGND) U?#6.41(DGND)  [project net SN]
OUTA+: U?#6.4(SPKR_OUTA+)
OUTA-: U?#6.6(SPKR_OUTA-)
OUTB+: U?#6.7(SPKR_OUTB+)
OUTB-: U?#6.9(SPKR_OUTB-)
RESET_DAC: R?#30.1 U?#6.32(RESET) ; port RESET_DAC
NetC?#36_1: C?#36.1 C?#37.1 FB?#3.1 U?#6.34(VD)
NetC?#38_1: C?#38.1 C?#39.1 C?#40.1 FB?#3.2 U?#6.13(+VHP) U?#6.16(VA)
NetC?#41_1: C?#41.1 U?#6.12(FLYP)
NetC?#41_2: C?#41.2 U?#6.11(FLYN)
NetC?#42_1: C?#42.1 U?#6.10(-VHPFILT)
NetC?#47_1: C?#47.1 U?#6.27(AFILTA)
NetC?#48_1: C?#48.1 U?#6.28(AFILTB)
NetC?#49_1: C?#49.1 U?#6.19(VQ)
NetC?#50_1: C?#50.1 U?#6.18(FILT+)
NetR?#25_2: U?#6.2(SCL) ; port SCL
NetR?#26_2: U?#6.1(SDA) ; port SDA
NetU?#6_37: U?#6.37(MCLK) ; port MCLK
NetU?#6_38: U?#6.38(SCLK) ; port SCLK
NetU?#6_39: U?#6.39(SDIN) ; port SDIN
NetU?#6_40: U?#6.40(LRCK) ; port LRCK

Not connected (* = marked no-connect by the designer): U?#6 14(HP/LINE_OUTB) 15(HP/LINE_OUTA) 20(TSTO)* 21(AIN4A)* 22(AIN4B)* 23(AIN3A)* 24(AIN3B)* 25(AIN2A)* 26(AIN2B)* 29(AIN1A)* 30(AIN1B)* 31(SPKR/HP) 36(TSTO)*

### Notes on the sheet
- (near U?#6) ADD 10010100

### Library data of the parts
C?#36 C?#40-C?#42 C?#49 = CAP_1uF-50V-5%-0805: as C?#10 on sheet stm32f103-debugger; Case/Package: 0805; Supplier-1: SIRICOM; Supplier Part Number-1: CL21B105KBFNNNE
C?#37-C?#39 C?#43 C?#45 C?#46 = CAP_0.1uF-50V-10%-0805: as C?#1 on sheet stm32f103-debugger; Case/Package: 0805; Supplier-1: SIRICOM; Supplier Part Number-1: 0805B104K500CT
C?#44 C?#50 = CAP_10uF-50V-10%-1206: as C?#13 on sheet Ethernet PHY; Case/Package: 1206; Supplier-1: SIRICOM; Supplier Part Number-1: CC1206KKX5R9BB106
C?#47 C?#48 = CAP_150pF-50V-10%-0805: 150pF ±10% 50V Ceramic Capacitor C0G, NP0 0805 (2012 Metric); Manufacturer: AVX Corporation; Manufacturer Part Number: 08055A151KAT2A; Alternate Part Number-1: NA; Case/Package: 0805; Supplier-1: Digikey; Supplier Part Number-1: 478-10501-1-ND - Cut Tape (CT)
FB?#3 = FB_1K-100MHZ-1.6A-0805: as FB?#1 on sheet Ethernet PHY; Case/Package: 0805; Supplier-1: SIRICOM; Supplier Part Number-1: ACMS201209A102
R?#30 = RES_10K-0.1W-1%-0603: as R?#4 on sheet stm32f103-debugger; Case/Package: 0603; Supplier-1: SIRICOM; Supplier Part Number-1: WR06X1002FTL
U?#6 = IC_CS43L22: Audio D/A Converter ICs Low Power Stereo DAC w/ClassD Spkr Driver; Manufacturer: Cirrus Logic; Alternate Part Number-1: NA; Manufacturer Part Number: CS43L22-CNZ; Case/Package: QFN-40; Supplier-1: Mouser; Supplier Part Number-1: 777-CS43L22-CNZ

## Sheet Stm32f407 controller.SchDoc
size A; SheetNumber: 9; SheetTotal: 9
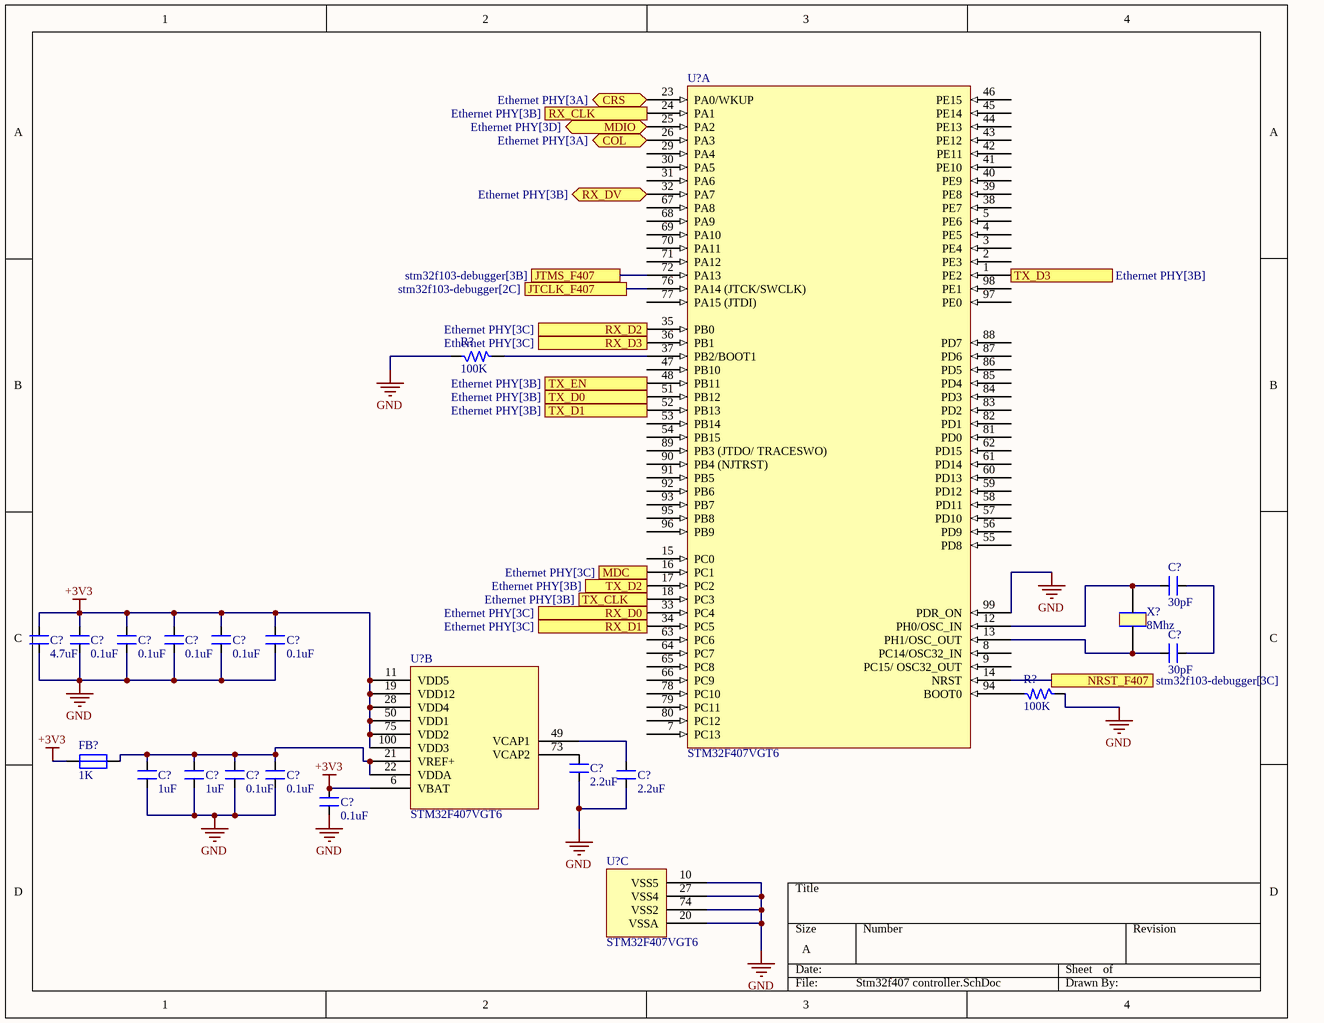
[diagram p8: Stm32f407 controller.SchDoc]

### Parts
(Parts that share a designator on the sheet are numbered #1, #2 ... from top to bottom, then left to right.)
C?#51  30pF  [CAP_0805]
C?#52  4.7uF  [CAP_0805]
C?#53  0.1uF  [CAP_0805]
C?#54  0.1uF  [CAP_0805]
C?#55  0.1uF  [CAP_0805]
C?#56  0.1uF  [CAP_0805]
C?#57  0.1uF  [CAP_0805]
C?#58  30pF  [CAP_0805]
C?#59  2.2uF  [CAP_0805]
C?#60  1uF  [CAP_0805]
C?#61  1uF  [CAP_0805]
C?#62  0.1uF  [CAP_0805]
C?#63  0.1uF  [CAP_0805]
C?#64  2.2uF  [CAP_0805]
C?#65  0.1uF  [CAP_0805]
FB?#4  1K  [IND_0805]
R?#31  100K  [RES_0603]
R?#32  100K  [RES_0603]
U?#7  STM32F407VGT6  [QFN100_19.6_669_58X10_SMD]  (part A of 3)
U?#8  STM32F407VGT6  [QFN100_19.6_669_58X10_SMD]  (part B of 3)
U?#9  STM32F407VGT6  [QFN100_19.6_669_58X10_SMD]  (part C of 3)
X?#2  8Mhz  [XTAL_314_240X47_SMD]

### Ports
COL (bidir, see Ethernet PHY[3A]), CRS (bidir, see Ethernet PHY[3A]), JTCLK_F407 (see stm32f103-debugger[2C]), JTMS_F407 (see stm32f103-debugger[3B]), MDC (out, see Ethernet PHY[3C]), MDIO (bidir, see Ethernet PHY[3D]), NRST_F407 (see stm32f103-debugger[3C]), RX_CLK (in, see Ethernet PHY[3B]), RX_D0 (out, see Ethernet PHY[3C]), RX_D1 (out, see Ethernet PHY[3C]), RX_D2 (out, see Ethernet PHY[3C]), RX_D3 (out, see Ethernet PHY[3C]), RX_DV (bidir, see Ethernet PHY[3B]), TX_CLK (out, see Ethernet PHY[3B]), TX_D0 (in, see Ethernet PHY[3B]), TX_D1 (in, see Ethernet PHY[3B]), TX_D2 (out, see Ethernet PHY[3B]), TX_D3 (in, see Ethernet PHY[3B]), TX_EN (in, see Ethernet PHY[3B])

### Nets
+3V3: C?#52.2 C?#53.2 C?#54.2 C?#55.2 C?#56.2 C?#57.2 C?#65.2 FB?#4.1 U?#8.6(VBAT) U?#8.11(VDD5) U?#8.19(VDD12) U?#8.28(VDD4) U?#8.50(VDD1) U?#8.75(VDD2) U?#8.100(VDD3)
GND: C?#52.1 C?#53.1 C?#54.1 C?#55.1 C?#56.1 C?#57.1 C?#59.1 C?#60.1 C?#61.1 C?#62.1 C?#63.1 C?#64.1 C?#65.1 R?#31.1 R?#32.1 U?#7.99(PDR_ON) U?#9.10(VSS5) U?#9.20(VSSA) U?#9.27(VSS4) U?#9.74(VSS2)  [project net SN]
COL: U?#7.26(PA3) ; port COL
NetC?#51_1: C?#51.1 U?#7.12(PH0/OSC_IN) X?#2.2
NetC?#51_2: C?#51.2 C?#58.2
NetC?#58_1: C?#58.1 U?#7.13(PH1/OSC_OUT) X?#2.1
NetC?#59_2: C?#59.2 U?#8.73(VCAP2)
NetC?#60_2: C?#60.2 C?#61.2 C?#62.2 C?#63.2 FB?#4.2 U?#8.21(VREF+) U?#8.22(VDDA)
NetC?#64_2: C?#64.2 U?#8.49(VCAP1)
NetR?#10_2: U?#7.25(PA2) ; port MDIO
NetR?#31_2: R?#31.2 U?#7.37(PB2/BOOT1)
NetR?#32_2: R?#32.2 U?#7.94(BOOT0)
NetU?#1_18: U?#7.76(PA14_(JTCK/SWCLK)) ; port JTCLK_F407
NetU?#1_25: U?#7.72(PA13) ; port JTMS_F407
NetU?#1_26: U?#7.14(NRST) ; port NRST_F407
NetU?#2_12: U?#7.16(PC1) ; port MDC
NetU?#2_13: U?#7.36(PB1) ; port RX_D3
NetU?#2_14: U?#7.35(PB0) ; port RX_D2
NetU?#2_15: U?#7.34(PC5) ; port RX_D1
NetU?#2_16: U?#7.33(PC4) ; port RX_D0
NetU?#2_18: U?#7.32(PA7) ; port RX_DV
NetU?#2_19: U?#7.24(PA1) ; port RX_CLK
NetU?#2_22: U?#7.18(PC3) ; port TX_CLK
NetU?#2_23: U?#7.48(PB11) ; port TX_EN
NetU?#2_24: U?#7.51(PB12) ; port TX_D0
NetU?#2_25: U?#7.52(PB13) ; port TX_D1
NetU?#2_26: U?#7.17(PC2) ; port TX_D2
NetU?#2_27: U?#7.1(PE2) ; port TX_D3
NetU?#2_29: U?#7.23(PA0/WKUP) ; port CRS

Not connected (* = marked no-connect by the designer): U?#7 2(PE3) 3(PE4) 4(PE5) 5(PE6) 7(PC13) 8(PC14/OSC32_IN) 9(PC15/_OSC32_OUT) 15(PC0) 29(PA4) 30(PA5) 31(PA6) 38(PE7) 39(PE8) 40(PE9) 41(PE10) 42(PE11) 43(PE12) 44(PE13) 45(PE14) 46(PE15) 47(PB10) 53(PB14) 54(PB15) 55(PD8) 56(PD9) 57(PD10) 58(PD11) 59(PD12) 60(PD13) 61(PD14) 62(PD15) 63(PC6) 64(PC7) 65(PC8) 66(PC9) 67(PA8) 68(PA9) 69(PA10) 70(PA11) 71(PA12) 77(PA15_(JTDI)) 78(PC10) 79(PC11) 80(PC12) 81(PD0) 82(PD1) 83(PD2) 84(PD3) 85(PD4) 86(PD5) 87(PD6) 88(PD7) 89(PB3_(JTDO/_TRACESWO)) 90(PB4_(NJTRST)) 91(PB5) 92(PB6) 93(PB7) 95(PB8) 96(PB9) 97(PE0) 98(PE1)

### Library data of the parts
C?#51 C?#58 = CAP_30pF-50V-10%-0805: as C?#7 on sheet stm32f103-debugger; Case/Package: 0805; Supplier-1: Digikey; Supplier Part Number-1: 399-17443-1-ND - Cut Tape (CT)
C?#52 = CAP_4.7uF-50V-10%-0805: 4.7µF ±10% 50V Ceramic Capacitor X5R 0805 (2012 Metric); Manufacturer: Yageo; Manufacturer Part Number: GRM21BR61H475KE51L; Alternate Part Number-1: NA; Case/Package: 0805; Supplier-1: SIRICOM; Supplier Part Number-1: CL21A475KBQNNNE
C?#53-C?#57 C?#62 C?#63 C?#65 = CAP_0.1uF-50V-5%-0805: as C?#11 on sheet stm32f103-debugger; Case/Package: 0805; Supplier-1: SIRICOM; Supplier Part Number-1: 0805B104J500CT
C?#59 C?#64 = CAP_2.2uF-25V-10%-0805: 2.2µF ±10% 25V Ceramic Capacitor X7R 0805 (2012 Metric); Manufacturer: KEMET; Manufacturer Part Number: CL21B225KAFNFNE; Alternate Part Number-1: NA; Case/Package: 0805; Supplier-1: SIRICOM; Supplier Part Number-1: CL21A225KAFNNNE
C?#60 C?#61 = CAP_1uF-50V-5%-0805: as C?#10 on sheet stm32f103-debugger; Case/Package: 0805; Supplier-1: SIRICOM; Supplier Part Number-1: CL21B105KBFNNNE
FB?#4 = FB_1K-100MHZ-1.6A-0805: as FB?#1 on sheet Ethernet PHY; Case/Package: 0805; Supplier-1: SIRICOM; Supplier Part Number-1: ACMS201209A102
R?#31 R?#32 = RES_100K-0.1W-1%-0603: as R?#1 on sheet stm32f103-debugger; Case/Package: 0603; Supplier-1: Arrow; Supplier Part Number-1: RMCF0603FT100K
U?#7-U?#9 = IC_STM32F407VGT6: ARM® Cortex®-M4 STM32F4 Microcontroller IC 32-Bit 168MHz 1MB (1M x 8) FLASH 100-LQFP (14x14); Manufacturer: STMicroelectronics; Alternate Part Number-1: STM32F407VET6; Manufacturer Part Number: STM32F407VGT6; Case/Package: LQFP100; Supplier-1: ARROW; Supplier Part Number-1: STM32F407VGT6
X?#2 = XTAL_8MHZ-ECS-80-32-5PX-SMD: as X?#1 on sheet stm32f103-debugger; Case/Package: SMD/SMT; Supplier-1: SP ROAD; Supplier Part Number-1: ECS-80-32-5PX-TR

## Nets that join several sheets
+3V3: stm32f103-debugger (15 pins), Motor Driver (R?#21.2), CH340C UART USB (C?#29.1 U?#4.4 U?#4.16), ADC Chip (8 pins), DAC schematic (8 pins), Stm32f407 controller (15 pins)
SN: stm32f103-debugger (24 pins), Ethernet PHY (20 pins), Motor Driver (11 pins), CH340C UART USB (C?#29.2 J?#5.5 J?#5.6 U?#4.1), ADC Chip (10 pins), DAC schematic (18 pins), Stm32f407 controller (20 pins)
COL: Ethernet PHY (DS?#1.A U?#2.28), Stm32f407 controller (U?#7.26)
NetR?#10_2: Ethernet PHY (R?#10.2 U?#2.11), Stm32f407 controller (U?#7.25)
NetR?#25_2: ADC Chip (R?#25.2 U?#5.16), DAC schematic (U?#6.2)
NetR?#26_2: ADC Chip (R?#26.2 U?#5.15), DAC schematic (U?#6.1)
NetU?#1_18: stm32f103-debugger (U?#1.18), Stm32f407 controller (U?#7.76)
NetU?#1_25: stm32f103-debugger (U?#1.25 U?#1.27), Stm32f407 controller (U?#7.72)
NetU?#1_26: stm32f103-debugger (U?#1.26), Stm32f407 controller (U?#7.14)
NetU?#2_12: Ethernet PHY (U?#2.12), Stm32f407 controller (U?#7.16)
NetU?#2_13: Ethernet PHY (U?#2.13), Stm32f407 controller (U?#7.36)
NetU?#2_14: Ethernet PHY (U?#2.14), Stm32f407 controller (U?#7.35)
NetU?#2_15: Ethernet PHY (U?#2.15), Stm32f407 controller (U?#7.34)
NetU?#2_16: Ethernet PHY (U?#2.16), Stm32f407 controller (U?#7.33)
NetU?#2_18: Ethernet PHY (U?#2.18), Stm32f407 controller (U?#7.32)
NetU?#2_19: Ethernet PHY (U?#2.19), Stm32f407 controller (U?#7.24)
NetU?#2_22: Ethernet PHY (U?#2.22), Stm32f407 controller (U?#7.18)
NetU?#2_23: Ethernet PHY (U?#2.23), Stm32f407 controller (U?#7.48)
NetU?#2_24: Ethernet PHY (U?#2.24), Stm32f407 controller (U?#7.51)
NetU?#2_25: Ethernet PHY (U?#2.25), Stm32f407 controller (U?#7.52)
NetU?#2_26: Ethernet PHY (U?#2.26), Stm32f407 controller (U?#7.17)
NetU?#2_27: Ethernet PHY (U?#2.27), Stm32f407 controller (U?#7.1)
NetU?#2_29: Ethernet PHY (U?#2.29), Stm32f407 controller (U?#7.23)